# EAGLE design Li-Po Rider v1.3 (EAGLE 6.4)
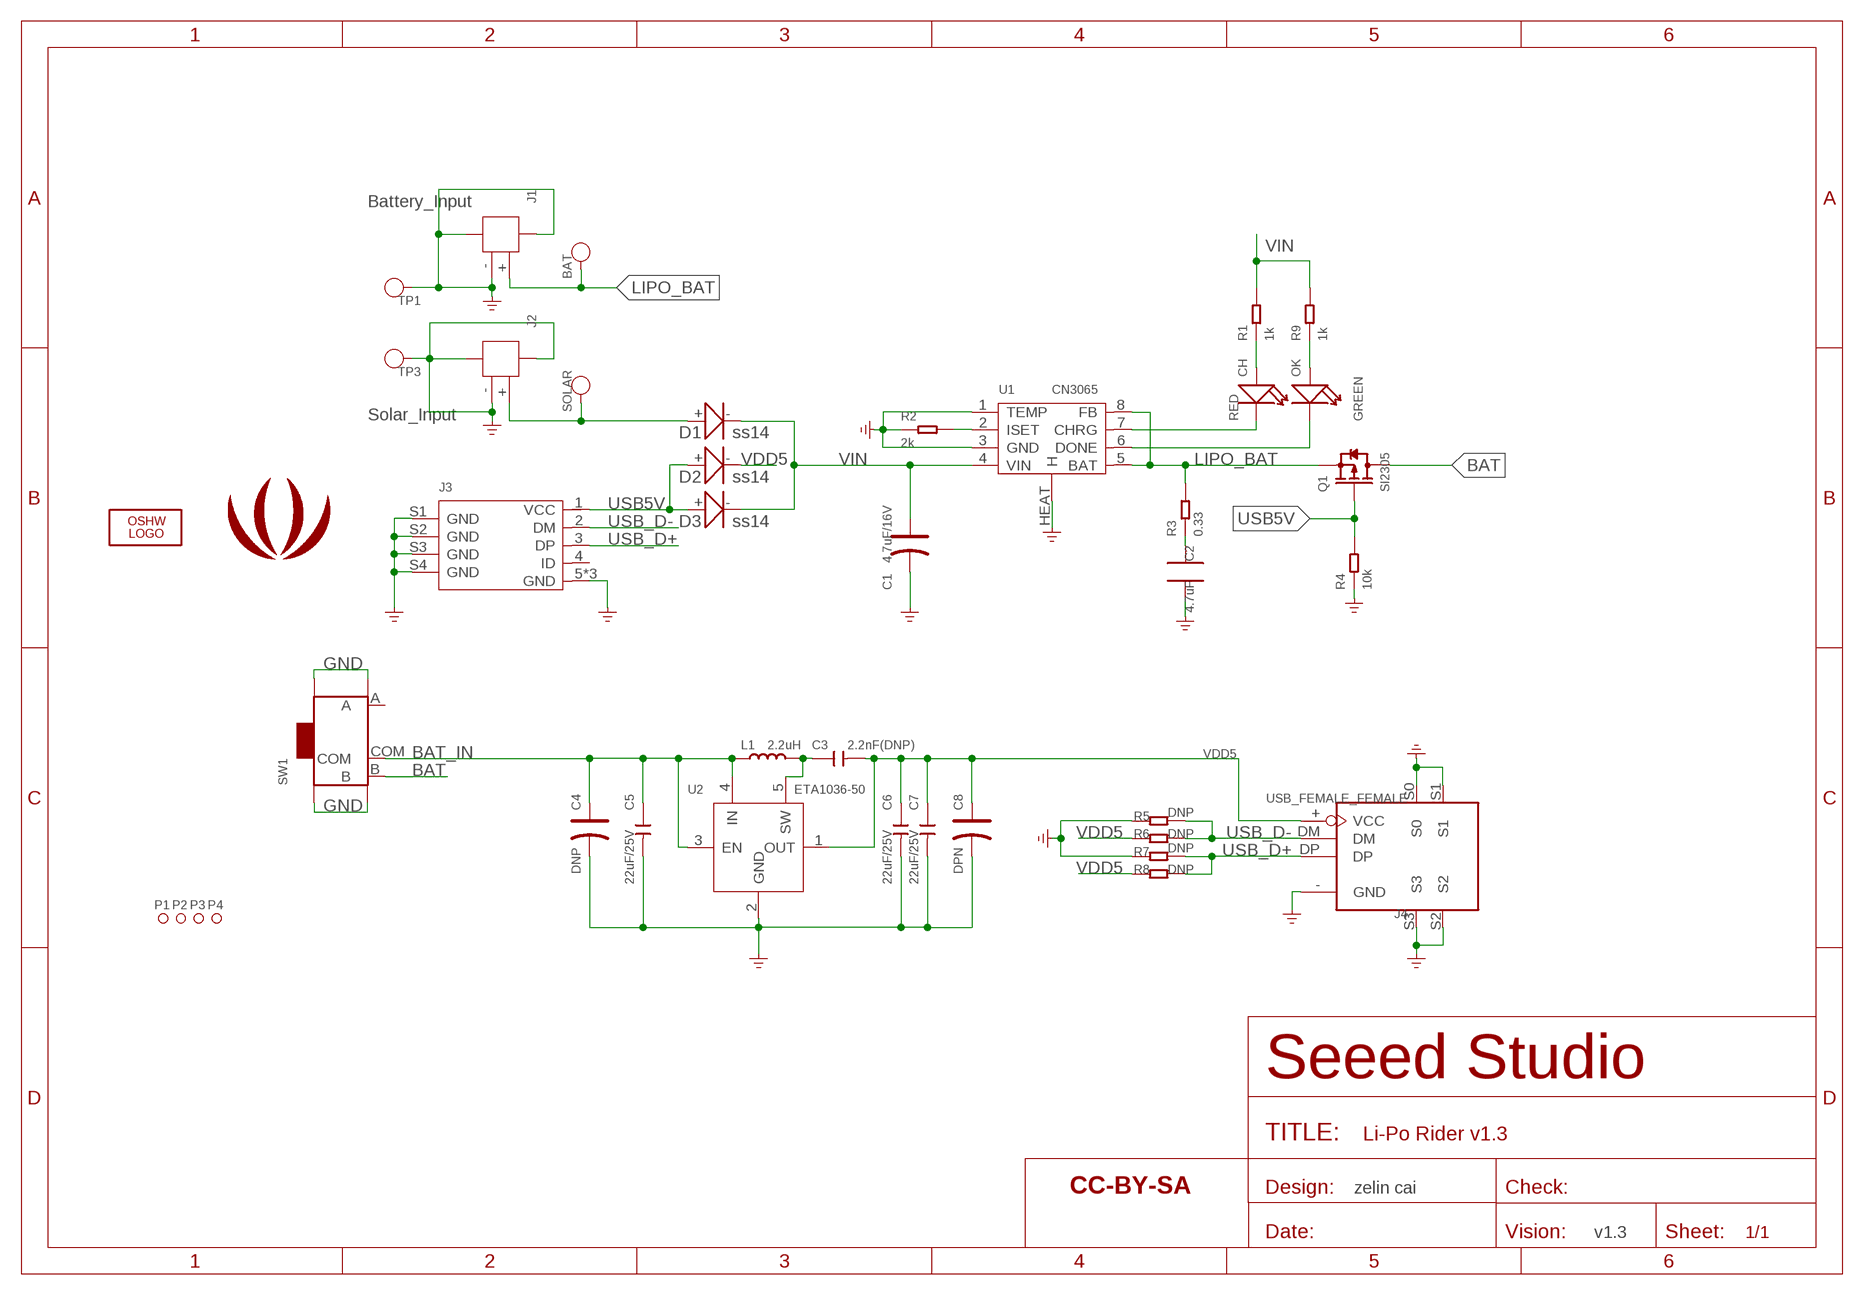
[diagram p0: schematic, sheet 1]

## Parts
BAT  PAD-TEST-POINT'4545'  [TP-D45MIL]
C1  4.7uF/16V  006-CAP_AVX_A  [AVX_A]
C2  4.7uF  C0805  [0805]
C3  2.2nF(DNP)  C-0603  [C0603]
C4  DNP  CAP-AVX-A  [AVX-A]
C5  22uF/25V  CAP-0805  [C0805]
C6  22uF/25V  CAP-0805  [C0805]
C7  22uF/25V  CAP-0805  [C0805]
C8  DPN  CAP-AVX-A  [AVX-A]
CH  RED  LED'0603'  [LED-0603]
D1  ss14  010-D2010  [D2010]
D2  ss14  010-D2010  [D2010]
D3  ss14  010-D2010  [D2010]
J1  JST-2P-SMD'2.0'  [2P-SMD-2.0-90D]
J2  JST-2P-SMD'2.0'  [2P-SMD-2.0-90D]
J3  USB-MICRO-5P'5+4P'  [5+4P-SMD-0.65-B]
J4  USB_FEMALE_FEMALE  USB_FEMALEHHS  [USB_FEMALE_HALF]
L1  2.2uH  INDUCTOR/FERRITE-BEAD'0630'  [L0630]
LOGO1  LOGO-OSHW-FILLX0200-NT  [OSHW_FILLX200_NOTEXT]
OK  GREEN  LED'0603'  [LED-0603]
P1  PAD-MARK'ANNULAR'  [ROUND-MARK-1.0]
P2  PAD-MARK'ANNULAR'  [ROUND-MARK-1.0]
P3  PAD-MARK'ANNULAR'  [ROUND-MARK-1.0]
P4  PAD-MARK'ANNULAR'  [ROUND-MARK-1.0]
Q1  SI2305  MOSFET-P'SI2323CDS/SI2305DS<BR>'  [SOT-23]
R1  1k  RES-0603  [R0603]
R2  2k  RES-0603  [R0603]
R3  0.33  RES-0603  [R0603]
R4  10k  RES-0603  [R0603]
R5  DNP  005-R0805  [0805]
R6  DNP  005-R0805  [0805]
R7  DNP  005-R0805  [0805]
R8  DNP  005-R0805  [0805]
R9  1k  RES-0603  [R0603]
SOLAR  PAD-TEST-POINT'4545'  [TP-D45MIL]
SW1  SWITCH-3+4P  [3+4P-SMD-L6.7*W2.7*H3.2MM]
TP1  PAD-TEST-POINT'4545'  [TP-D45MIL]
TP3  PAD-TEST-POINT'4545'  [TP-D45MIL]
U1  CN3065  PMIC-CN3065-DFN8  [DFN-8]
U2  ETA1036-50  ETA1036  [SOT23-5]
U$1  LOGO-SEEEDSTUDIO-SILK  [LOGO_SILK]
U$2  SEEEDSTUDIO-OPEN-SCH-FRAME  [SEEEDSTUDIO-PCB-FRAME]

## Nets
BAT: Q1.3(D) SW1.B
BAT_IN: C4.+ C5.1 L1.1 SW1.COM U2.3(EN) U2.4(IN)
GND: C1.- C2.2 C4.- C5.2 C6.2 C7.2 C8.- J1.3 J1.4 J1.- J2.3 J2.4 J2.- J3.5(GND) J3.S1(GND) J3.S2(GND) J3.S3(GND) J3.S4(GND) J3.S5(GND) J3.S6(GND) J4.-(GND) J4.S0 J4.S1 J4.S2 J4.S3 R2.1 R4.1 R5.2 R7.2 SW1.SS1 SW1.SS2 SW1.SS3 SW1.SS4 TP1.T TP3.T U1.1(TEMP) U1.3(GND) U1.HEAT(H) U2.2(GND) ; supply symbol labelled GND_POWER
LIPO_BAT: BAT.T J1.+ Q1.2(S) R3.2 U1.5(BAT) U1.8(FB)
N$1: C2.1 R3.1
N$2: C3.1 L1.2 U2.5(SW)
N$3: D1.+ J2.+ SOLAR.T
N$4: CH.+ R1.1
N$13: R2.2 U1.2(ISET)
N$14: CH.- U1.7(CHRG)
N$15: OK.- U1.6(DONE)
N$16: OK.+ R9.1
USB5V: D2.+ D3.+ J3.1(VCC) Q1.1(G) R4.2
USB_D+: J3.3(DP) J4.DP R7.1 R8.1
USB_D-: J3.2(DM) J4.DM R5.1 R6.1
VDD5: C3.2 C6.1 C7.1 C8.+ D2.- J4.+(VCC) R6.2 R8.2 U2.1(OUT)
VIN: C1.+ D1.- D3.- R1.2 R9.2 U1.4(VIN)
Unconnected: J3.4(ID) SW1.A

## Notes on the sheet
- Battery_Input
- Solar_Input
- zelin cai
- v1.3

## Library data of the parts
BAT SOLAR TP1 TP3 = Discrete-new:PAD-TEST-POINT; PARTNO: DNP
C1 = Discrete:006-CAP*: Electrolytic Capacitors,Tantalum Capacitors and Super Capacitors
C2 = CPT_SMD:C0805
C3 = Discrete:C*: Ceramic Capacitors
C4 C8 = Discrete:CAP*: Electrolytic Capacitors,Tantalum Capacitors and Super Capacitors
C5-C7 = Discrete-new:CAP: Ceramic Capacitors
CH OK = Discrete-new:LED
D1-D3 = Discrete:010-D*
J1 J2 = Connector-new:JST-2P-SMD: 2P-SMD-1.0-90D:320110054;2P-SMD-2.0-90D:320110026
J3 = Connector-new:USB-MICRO-5P: 5+4P-SMD-0.65-B:320010000;5+2P-SMD-0.65-AB:340032001
J4 = CONNECTER:USB_FEMALE
L1 = Discrete-new:INDUCTOR/FERRITE-BEAD
LOGO1 = logo:LOGO-OSHW-FILL; PARTNO: DNP
P1-P4 = Discrete-new:PAD-MARK; PARTNO: DNP
Q1 = Discrete-new:MOSFET-P
R1-R4 R9 = Discrete-new:RES
R5-R8 = Discrete:005-R*
SW1 = Discrete-new:SWITCH-3+4P: 3+4P-SMD-L6.7*W2.6*H1.4MM-90D:311030002;3+4P-SMD-L6.7*W2.7*H3.2MM:311030001
U1 = IC-new:PMIC-CN3065: 310030101
U2 = IC:ETA1036
U$1 = logo:LOGO-SEEEDSTUDIO
U$2 = moudle-new:SEEEDSTUDIO-OPEN-SCH-FRAME

## Net classes
0 default: width 0.203 mm, drill 0.305 mm, clearance 0.127 mm

## Board
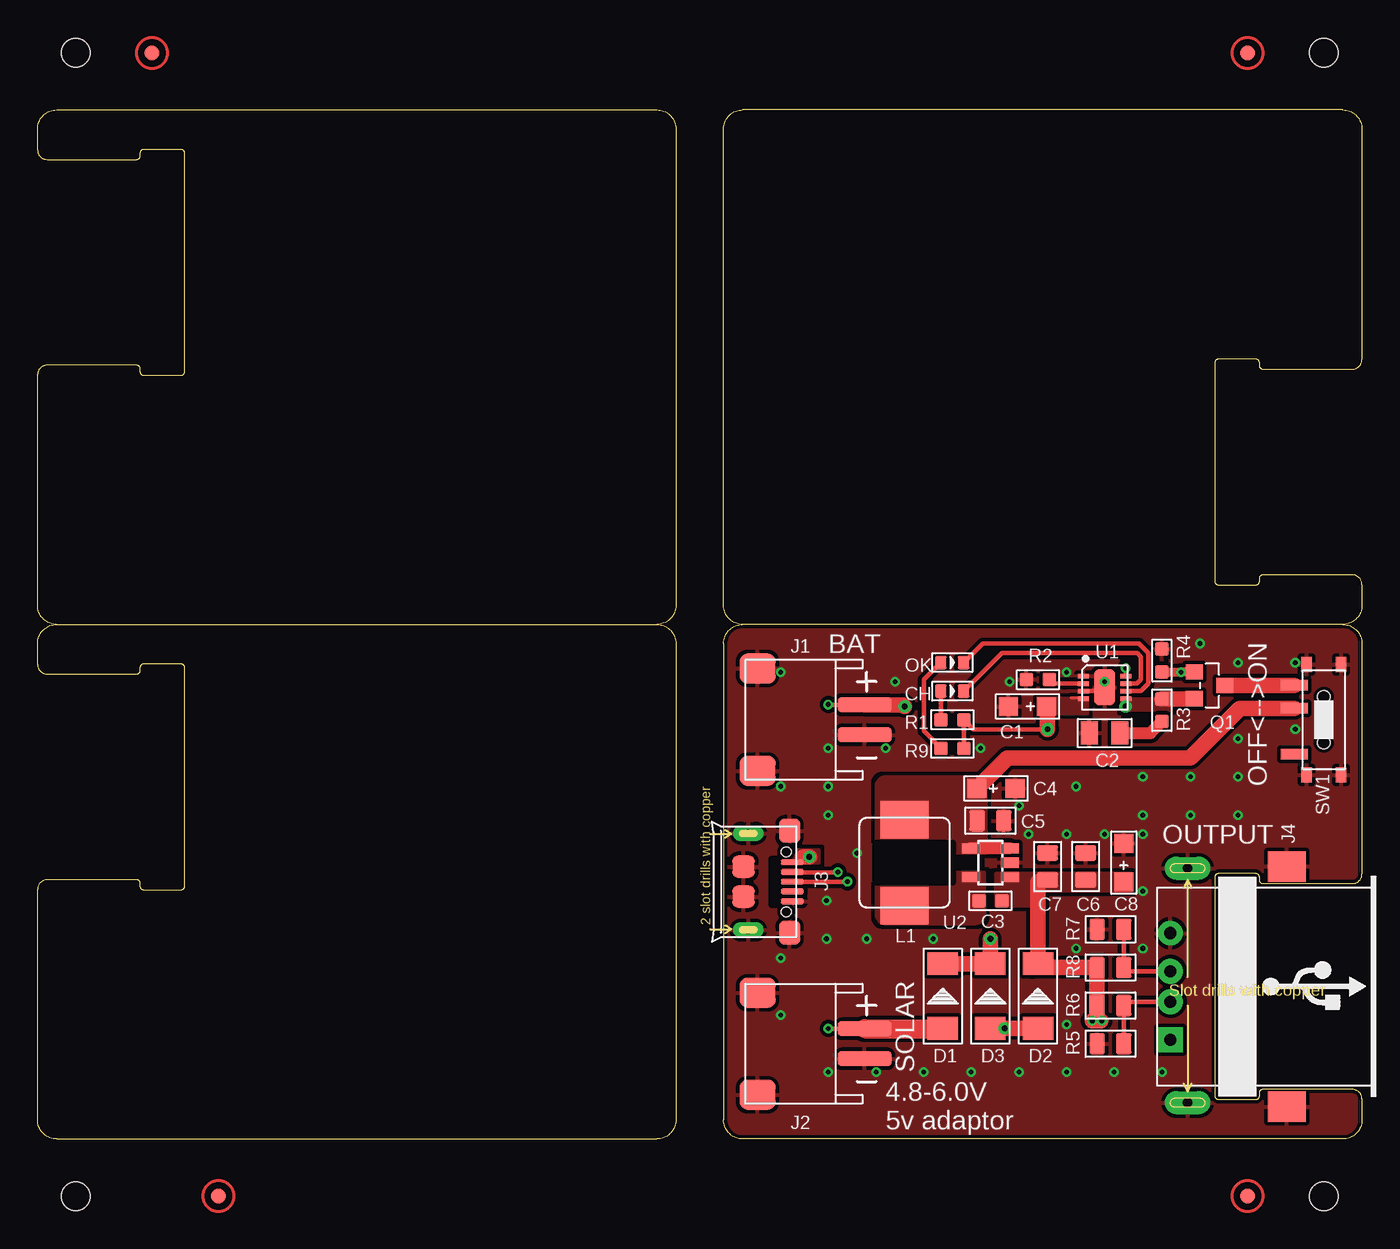
[diagram p1: board, top side]
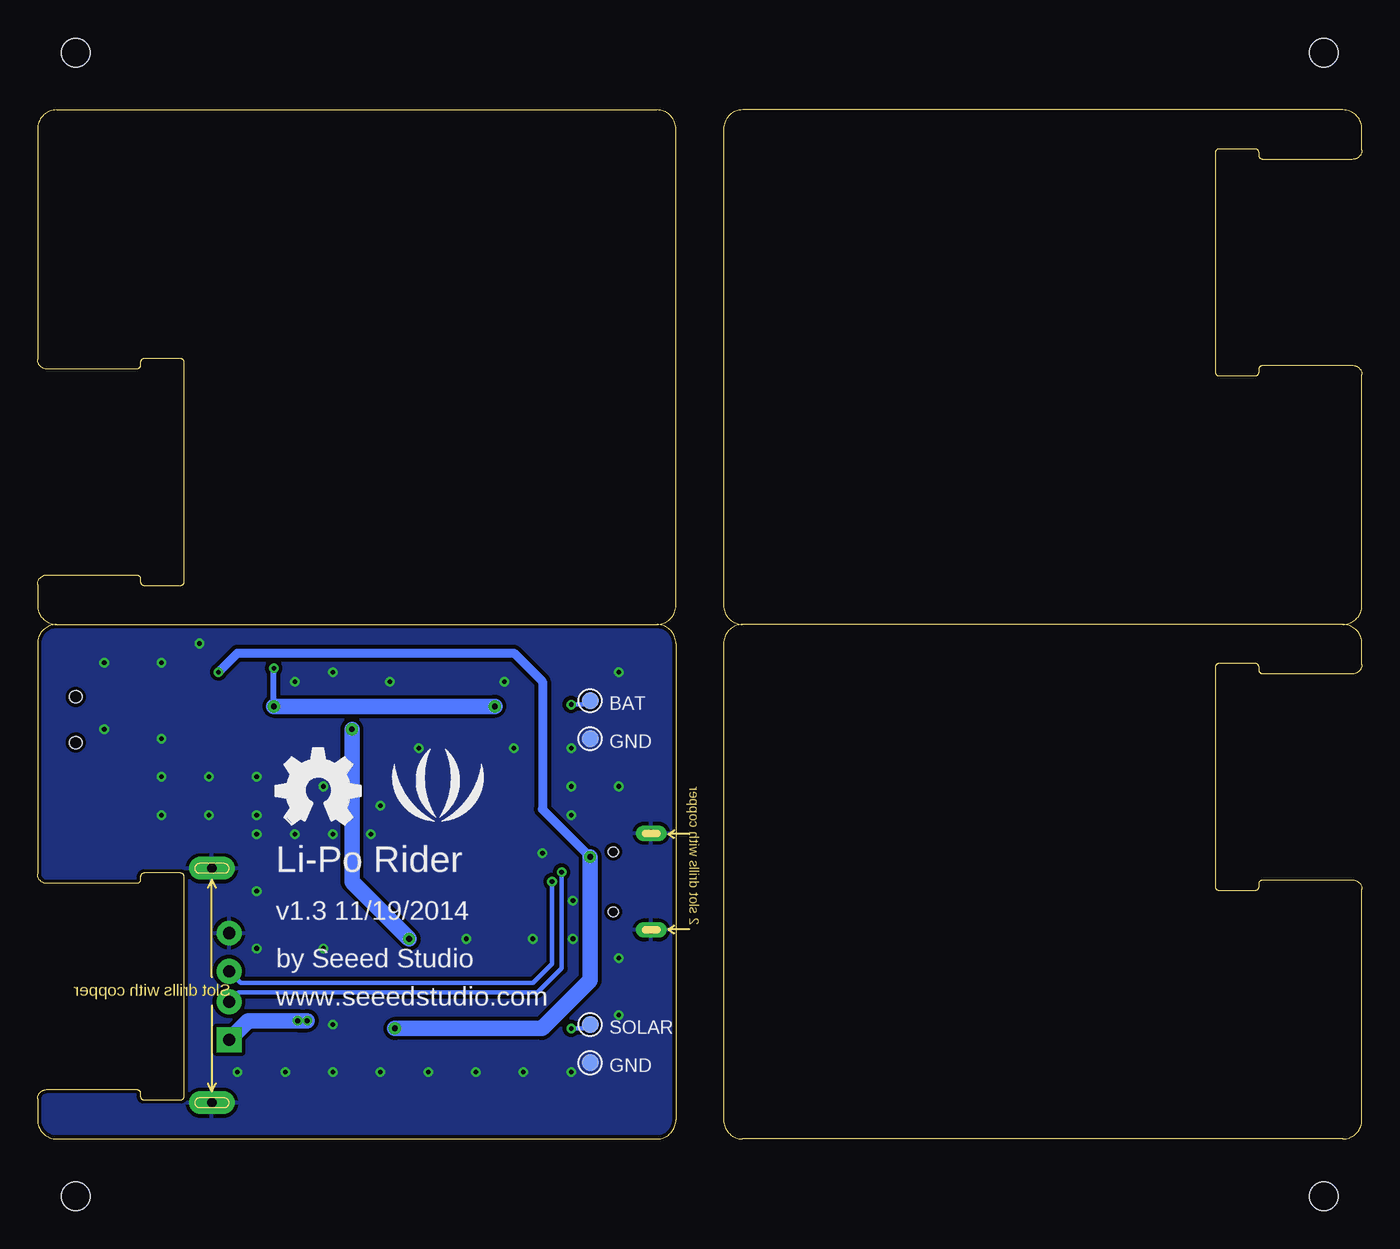
[diagram p2: board, bottom side, seen from below]

Size 88.27 x 68.58 mm. Coordinates in mm from the lower left corner, seen from the top.
Outline: 87,34.29 arc-90 88.27,33.02 88.27,17.65 arc-90 87.63,17.02 81.66,17.02 arc-90 81.41,17.27 81.41,17.46 arc90 81.15,17.72 78.74,17.72 arc90 78.49,17.46 78.49,2.86 arc90 78.74,2.6 81.15,2.6 arc90 81.41,2.86 81.41,3.05 arc-90 81.66,3.3 87.63,3.3 arc-90 88.27,2.67 88.27,1.27 arc-90 87,0 46.99,0 arc-90 45.72,1.27 45.72,33.02 arc-90 46.99,34.29
Outline: 41.27,34.29 arc-90 42.55,33.02 42.55,1.27 arc-90 41.27,0 1.27,0 arc-90 0,1.27 0,16.64 arc-90 0.63,17.27 6.6,17.27 arc-90 6.86,17.02 6.86,16.83
Outline: 1.27,34.29 arc90 0,33.02 0,31.62 arc90 0.63,30.99 6.6,30.99 arc90 6.86,31.24 6.86,31.43
Outline: 6.86,31.43 arc-90 7.11,31.69
Outline: 9.52,31.69 arc-90 9.78,31.43
Outline: 9.78,16.83 arc-90 9.52,16.57
Outline: 7.11,16.57 arc-90 6.86,16.83
Outline: 1.27,34.29 arc-90 0,35.56 0,50.93 arc-90 0.63,51.56 6.6,51.56 arc-90 6.86,51.31 6.86,51.12
Outline: 41.27,34.29 arc90 42.55,35.56 42.55,67.31 arc90 41.27,68.58 1.27,68.58 arc90 0,67.31 0,65.91 arc90 0.63,65.28 6.6,65.28 arc90 6.86,65.53 6.86,65.72
Outline: 6.86,65.72 arc-90 7.11,65.98
Outline: 9.52,65.98 arc-90 9.78,65.72
Outline: 9.78,51.12 arc-90 9.52,50.86
Outline: 7.11,50.86 arc-90 6.86,51.12
Outline: 1.27,34.29 41.27,34.29
Outline: 87,34.29 46.99,34.29
Outline: 46.99,34.29 arc-90 45.72,35.56 45.72,67.31 arc-90 46.99,68.58 87,68.58 arc-90 88.27,67.31 88.27,51.94 arc-90 87.63,51.31 81.66,51.31 arc-90 81.41,51.56 81.41,51.75
Outline: 87,34.29 arc90 88.27,35.56 88.27,36.96 arc90 87.63,37.59 81.66,37.59 arc90 81.41,37.34 81.41,37.15
Outline: 81.41,37.15 arc-90 81.15,36.89
Outline: 78.74,36.89 arc-90 78.49,37.15
Outline: 78.49,51.75 arc-90 78.74,52.01
Outline: 81.15,52.01 arc-90 81.41,51.75
Outline: 6.86,31.43 arc-90 7.11,31.69
Outline: 7.11,31.69 9.52,31.69
Outline: 9.52,31.69 arc-90 9.78,31.43
Outline: 9.78,31.43 9.78,16.83
Outline: 9.78,16.83 arc-90 9.52,16.57
Outline: 9.52,16.57 7.11,16.57
Outline: 7.11,16.57 arc-90 6.86,16.83
Outline: 6.86,65.72 arc-90 7.11,65.98
Outline: 7.11,65.98 9.52,65.98
Outline: 9.52,65.98 arc-90 9.78,65.72
Outline: 9.78,65.72 9.78,51.12
Outline: 9.78,51.12 arc-90 9.52,50.86
Outline: 9.52,50.86 7.11,50.86
Outline: 7.11,50.86 arc-90 6.86,51.12
Outline: 81.41,37.15 arc-90 81.15,36.89
Outline: 81.15,36.89 78.74,36.89
Outline: 78.74,36.89 arc-90 78.49,37.15
Outline: 78.49,37.15 78.49,51.75
Outline: 78.49,51.75 arc-90 78.74,52.01
Outline: 78.74,52.01 81.15,52.01
Outline: 81.15,52.01 arc-90 81.41,51.75
Copper layers (1*16): Top 0.035mm / dielectric 1.5mm / Bottom 0.035mm
Design rules "SeeedStudio_DRU_no_angle_20130527": minimum track width 6mil, minimum drill 12mil, track to track 6mil, track to pad 6mil, pad to pad 6mil, via to via 6mil, smd to smd 0mil, copper to edge 10mil, drill to drill 10mil, minimum pad ring 10mil, minimum via ring 6mil, stop-mask expansion 2mil, vias tented up to drill 25mil, thermal gap 10mil
Holes 1.91 mm at 2.54,-3.81 85.72,-3.81 85.72,72.39 2.54,72.39
tRestrict: area 55.9,18.2 to 62.9,18.7; area 55.9,17.1 to 61,19.7

### Footprints (pad centres in the part's own frame; a part is rotated, then mirrored left to right if it is on the bottom)
TP-D45MIL = smd 1.143 x 1.143: T 0,0
AVX_A = smd 1.27 x 1.27: + -1.27,0; - 1.27,0
0805 = smd 1.143 x 1.524: 1 -1.016,0; 2 1.016,0
C0603 = smd 0.889 x 0.889: 1 -0.762,0; 2 0.762,0
AVX-A = smd 1.27 x 1.27: + -1.27,0; - 1.27,0
C0805 = smd 1.016 x 1.397: 1 -0.889,0; 2 0.889,0
LED-0603 = smd 0.762 x 0.889: + -0.762,0; - 0.762,0
D2010 = smd 1.524 x 2.032: + -2.159,0; - 2.159,0
2P-SMD-2.0-90D = smd 2 x 2.4: 3 3.4,-2.181; 4 -3.4,-2.181 | smd 1 x 3.6: + -1,4.953; - 1,4.953
5+4P-SMD-0.65-B = smd 0.381 x 1.524: 1 -1.3,-0.25; 2 -0.65,-0.25; 3 0,-0.25; 4 0.65,-0.25; 5 1.3,-0.25 | smd 1.6 x 1.397: S1 -3.4,-0.427; S6 3.4,-0.427 | drill 0.508 pad 1.016 long: S2 -3.226,-3.175; S5 3.226,-3.175 | smd 1.5 x 1.5: S3 -1,-3.5; S4 1,-3.5 | hole 0.635: -2,-0.65; 2,-0.65
USB_FEMALE_HALF = drill 0.813 pad 1.651 square: + 0.889,-3.556 | drill 0.813 pad 1.651: - 0.889,3.556; DM 0.889,-1.016; DP 0.889,1.016 | smd 2.54 x 2.032: S0 8.636,8.001; S3 8.636,-8.001 | drill 0.635 pad 1.524 long: S1 2.032,7.874; S2 2.032,-7.747
L0630 = smd 2.5 x 3.2: 1 -2.85,0; 2 2.85,0
ROUND-MARK-1.0 = smd 1.016 x 1.016: P$1 0,0
SOT-23 = smd 1.016 x 1.143: 1 -0.889,-1.016; 2 0.889,-1.016; 3 0,1.016
R0603 = smd 0.889 x 0.889: 1 -0.762,0; 2 0.762,0
0805' = smd 1.016 x 1.397: 1 -0.889,0; 2 0.889,0
3+4P-SMD-L6.7*W2.7*H3.2MM = smd 1.8 x 0.7: A 1.978,2.286; B 1.978,-2.286; COM 1.978,-0.762 | smd 0.7 x 1.016: SS1 -1.15,-3.683; SS2 1.15,-3.683; SS3 1.15,3.683; SS4 -1.15,3.683 | hole 0.813: 0,-1.524; 0,1.524
DFN-8 = smd 0.3 x 0.727: 1 -0.75,-1.413; 2 -0.25,-1.413; 3 0.25,-1.413; 4 0.75,-1.413; 5 0.75,1.413; 6 0.25,1.413; 7 -0.25,1.413; 8 -0.75,1.413 | smd 2.413 x 1.397: HEAT 0,0
SOT23-5 = smd 0.69 x 1.2: 1 -0.95,-1.3; 2 0,-1.3; 3 0.95,-1.3; 4 0.95,1.3; 5 -0.95,1.3

### Placement (x,y rotation side)
BAT  51.44,29.21 0 bottom
C1  65.98,28.83 180 top
C2  71.12,27.05 180 top
C3  63.5,15.88 0 top
C4  63.88,23.37 0 top
C5  63.5,21.21 0 top
C6  69.85,18.16 90 top
C7  67.31,18.16 90 top
C8  72.39,18.41 90 top
CH  60.96,29.84 0 top
D1  60.33,9.53 90 top
D2  66.67,9.53 90 top
D3  63.5,9.53 90 top
J1  50.16,27.94 270 top
J2  50.16,6.35 270 top
J3  50.55,17.14 270 top
J4  74.61,10.16 0 top
L1  57.78,18.41 270 top
LOGO1  72.39,20.95 0 bottom
OK  60.96,31.75 0 top
P1  12.06,-3.81 0 top  (outside the outline)
P2  80.64,-3.81 0 top  (outside the outline)
P3  80.64,72.39 0 top  (outside the outline)
P4  7.62,72.39 0 top  (outside the outline)
Q1  78.1,30.23 270 top
R1  60.96,27.94 0 top
R2  66.67,30.61 0 top
R3  74.93,28.57 90 top
R4  74.93,31.88 270 top
R5  DNP  [0805']  71.5,6.35 180 top
R6  DNP  [0805']  71.5,8.89 180 top
R7  DNP  [0805']  71.5,13.97 180 top
R8  DNP  [0805']  71.5,11.43 180 top
R9  60.96,26.04 0 top
SOLAR  51.44,7.62 0 bottom
SW1  85.72,27.94 180 top
TP1  51.44,5.08 0 bottom
TP3  51.44,26.67 0 bottom
U1  71.12,30.1 270 top
U2  63.5,18.41 90 top
U$1  61.59,22.86 0 bottom
U$2  -1.91,-17.14 0 top  (outside the outline)

### Tracks (layer width: path | path; a pad name or v marks a point on that pad's centre or on a via)
BAT
  Top 1.016: SW1.B Q1.3
BAT_IN
  Top 0.813: U2.3 U2.4
  Top 1.016: SW1.COM 80.14,28.7 76.83,25.4 64.64,25.4 C4.+
  pour Top (isolate 0.254, no thermals): 61.59,19.05 63.25,19.05 63.25,24.13 56.52,24.13 arc90 55.88,23.5 55.88,19.68 arc90 56.52,19.05
GND  (via drill 0.3 pad 0.64)
  Top 0.305: U1.3 71.12,29.85 71.12,29.84 U1.HEAT
  other vias: 71.12,30.48 64.77,30.48 65.41,22.23 68.58,20.32 71.12,20.32 73.66,20.32 69.22,12.7 68.58,7.62 68.58,4.45 71.75,4.45 65.41,4.45 62.23,4.45 59.05,4.45 73.66,16.51 73.66,12.7 55.88,4.45 52.7,4.45 49.53,8.26 68.58,31.11 55.24,13.34 59.69,13.34 73.66,24.13 76.83,24.13 80.01,24.13 80.01,26.67 83.82,27.3 69.22,23.5 62.86,26.04 56.52,26.04 52.7,26.04 83.82,31.75 80.01,31.75 77.47,33.02 52.58,15.88 52.58,13.34 52.7,23.5 52.7,21.59 54.61,19.05 66.04,20.32 74.93,4.45 49.53,12.06 49.53,23.5 49.53,31.11 57.15,30.48 80.01,21.59 76.83,21.59 73.66,21.59
  pour Top (isolate 0.254, rank 6): 45.72,34.29 88.27,34.29 88.27,0 45.72,0
  pour Bottom (isolate 0.254, rank 6): 45.72,34.29 88.27,34.29 88.27,0 45.72,0
LIPO_BAT  (via drill 0.3 pad 0.64, 0.38 pad 0.81)
  Top 0.203: 54.61,28.83 54.74,28.96 | 54.74,28.96 54.72,28.96 54.66,28.89 | 54.74,28.96 55.1,28.96 J1.+
  Top 0.305: U1.8 72.53,31.35 v72.52,31.37 | 54.66,28.89 arc-45 54.65,28.86 | 54.61,28.83 54.61,28.7 | J1.+ 52.72,28.94 v52.7,28.96
  Top 1.016: Q1.2 R3.2 | J1.+ 57.67,28.94 v57.78,28.83
  Bottom 0.305: v52.7,28.96 51.69,28.96 BAT.T
  Bottom 0.406: v72.52,28.83 v72.52,31.37
  Bottom 1.016: v72.52,28.83 v57.78,28.83
  pour Top (isolate 0.254, no thermals): 72.26,29.34 72.26,28.57 75.56,28.57 75.56,29.34
N$1
  Top 0.813: C2.1 74.17,27.05 R3.1
N$2
  pour Top (isolate 0.254, no thermals): 63.12,15.49 63.12,17.78 56.52,17.78 arc90 55.88,17.14 55.88,14.99 arc90 56.52,14.35 62.48,14.35 arc90 63.12,14.99 63.12,15.37
N$3  (via drill 0.3 pad 0.64)
  Top 0.305: J2.+ 52.72,7.35 v52.7,7.37
  Top 1.27: J2.+ 59.67,7.35 D1.+
  Bottom 0.305: v52.7,7.37 51.69,7.37 SOLAR.T
N$4
  Top 0.305: CH.+ R1.1
N$13
  Top 0.305: U1.2 68.41,30.35 67.89,30.35 67.69,30.35 R2.2
N$14
  Top 0.305: U1.7 73.28,30.35 73.53,30.61 73.53,32.13 73.28,32.38 64.26,32.38 CH.-
N$15
  Top 0.305: U1.6 73.54,29.85 74.04,30.35 74.04,32.38 73.41,33.02 62.99,33.02 OK.-
N$16
  Top 0.305: R9.1 59.05,27.18 59.05,30.61 OK.+ 60.33,31.88
USB5V  (via drill 0.3 pad 0.64, 0.38 pad 0.81)
  Top 0.61: Q1.1 v76.2,31.11 R4.2
  Top 1.016: D2.+ D3.+ v64.45,7.37 | v51.44,18.8 51.05,18.8
  Bottom 0.61: v76.2,31.11 74.93,32.38 56.52,32.38 54.61,30.48 54.61,21.97 v51.44,18.8
  Bottom 1.016: v51.44,18.8 51.44,10.58 54.65,7.37 v64.45,7.37
  pour Top (isolate 0.254, no thermals): 49.53,18.35 49.53,19.3 52.07,19.3 52.07,18.35
USB_D+  (via drill 0.3 pad 0.64)
  Top 0.305: R7.1 R8.1 72.64,11.18 J4.DP | J3.3 v53.98,17.14
  Bottom 0.305: J4.DP 74.74,10.41 55.24,10.41 53.98,11.68 v53.98,17.14
USB_D-  (via drill 0.3 pad 0.64)
  Top 0.305: J4.DM 72.64,9.14 R6.1 R5.1 | 50.16,17.78 50.18,17.8 J3.2 v53.34,17.78
  Bottom 0.305: J4.DM 74.87,9.78 54.93,9.78 53.34,11.37 v53.34,17.78
VDD5  (via drill 0.3 pad 0.64)
  Top 1.016: v70.3,7.87 70.61,7.87 | 70.61,7.87 70.87,7.87 | 70.61,7.87 R6.2 R8.2 66.29,11.43 D2.- 66.67,17.14
  Bottom 1.016: v70.3,7.87 v70.93,7.87 74.23,7.87 J4.+
  pour Top (isolate 0.254, no thermals): 63.88,15.49 63.88,17.72 72.9,17.72 72.9,16.51 66.67,16.51 66.67,15.49
VIN  (via drill 0.38 pad 0.81)
  Top 0.203: U1.4 69.71,29.38 69.72,29.4 68.9,29.4
  Top 0.305: 61.72,27.81 R1.2 62.36,27.3 v67.31,27.3 | 61.72,27.81 R9.2 | 61.85,27.69 61.72,27.81
  Top 1.016: D1.- D3.- v63.5,13.34 | v67.31,27.3 67.31,28.77 C1.+
  Bottom 1.016: v63.5,13.34 67.31,17.14 v67.31,27.3
  pour Top (isolate 0.254, no thermals): 66.8,29.4 69.98,29.4 69.98,28.32 66.8,28.32

### Text on the board
tPlace: BAT | OFF<-->ON | OUTPUT | SOLAR | 4.8-6.0V | 5v adaptor
bPlace: GND | Li-Po Rider | v1.3 11/19/2014 | by Seeed Studio | www.seeedstudio.com | GND